# EAGLE design led kocka shematic (EAGLE 8.4.3)
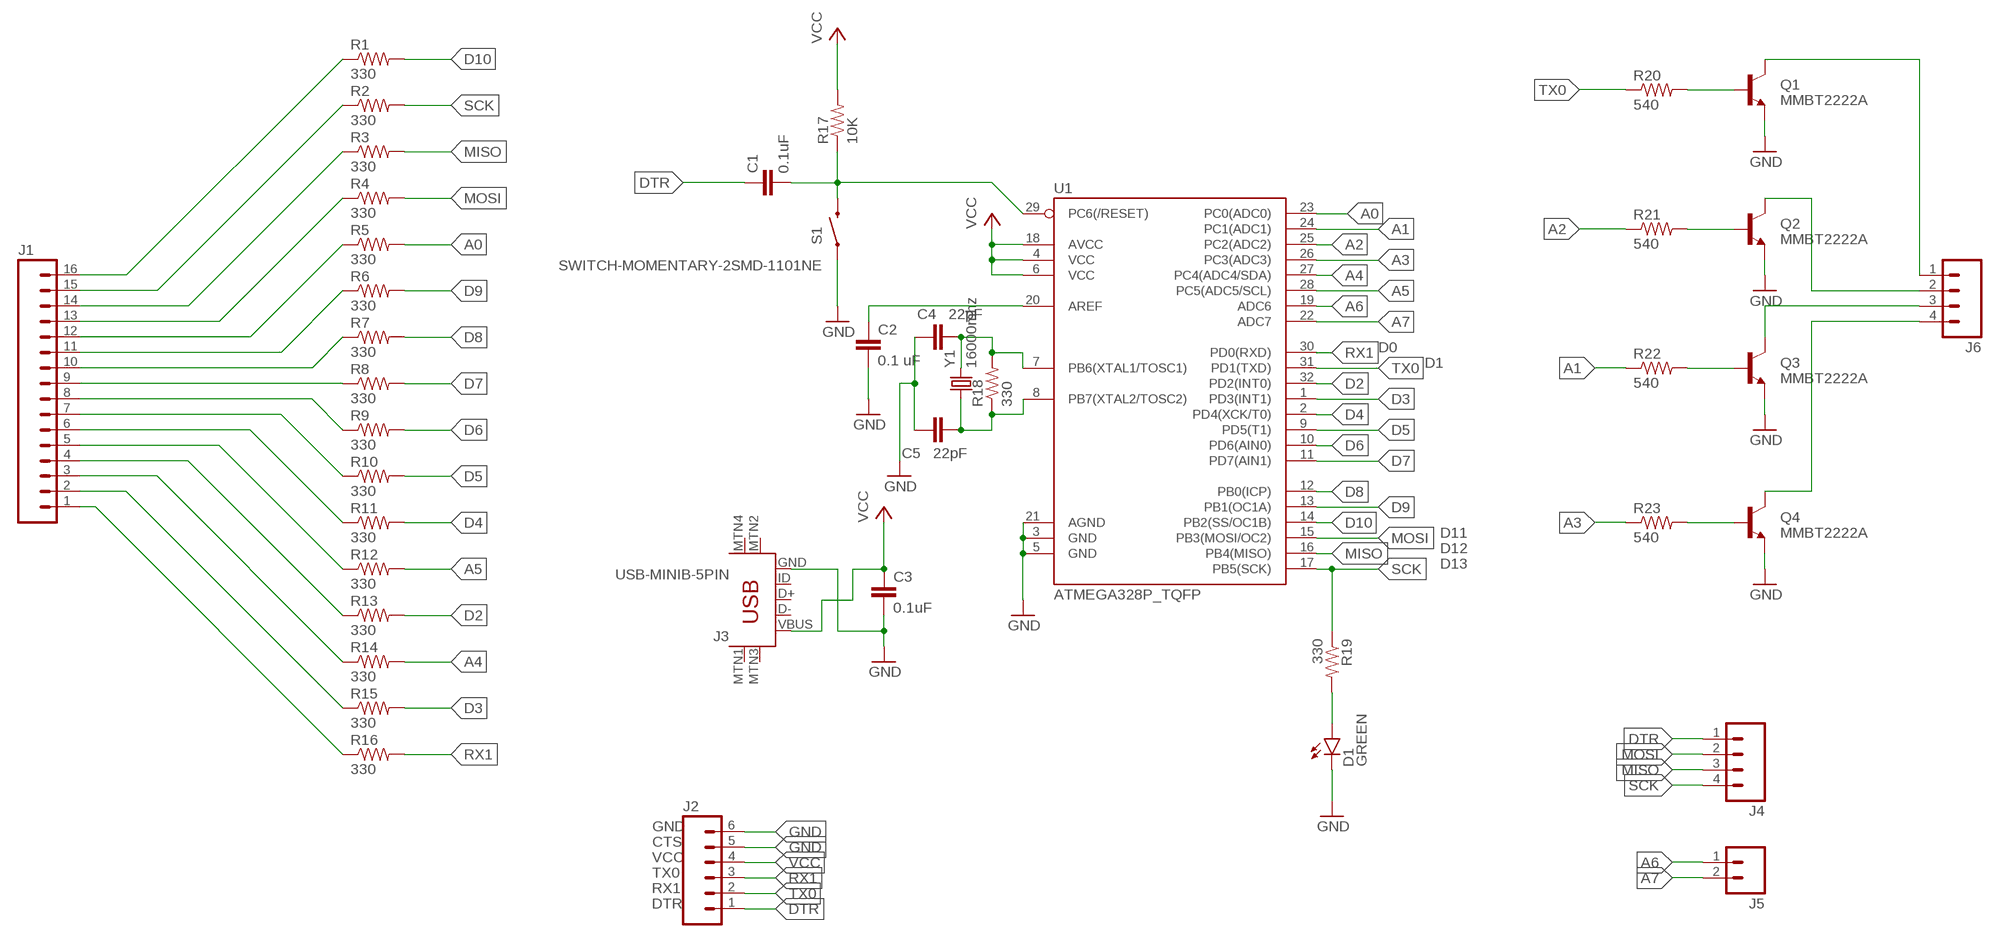
[diagram p0: schematic, sheet 1]

## Parts
C1  0.1uF  1UF-25V-10%(0805)"  [0805-CAP]
C2  0.1 uF  1UF-25V-10%(0805)"  [0805-CAP]
C3  0.1uF  1UF-25V-10%(0805)"  [0805-CAP]
C4  22pF  1UF-25V-10%(0805)"  [0805-CAP]
C5  22pF  1UF-25V-10%(0805)"  [0805-CAP]
D1  GREEN  LED-GREEN0603  [LED-0603]
J1  M16LONGPADS  [1X16_LONGPADS]
J2  M06LONGPADS  [1X06_LONGPADS]
J3  USB-MINIB-5PIN  [USB-MINIB]
J4  M04LONGPADS  [1X04_LONGPADS]
J5  M02LOCK_LONGPADS  [1X02_LOCK_LONGPADS]
J6  M04LONGPADS  [1X04_LONGPADS]
Q1  MMBT2222A  TRANSISTOR_NPNMMBT2222A  [SOT23-3]
Q2  MMBT2222A  TRANSISTOR_NPNMMBT2222A  [SOT23-3]
Q3  MMBT2222A  TRANSISTOR_NPNMMBT2222A  [SOT23-3]
Q4  MMBT2222A  TRANSISTOR_NPNMMBT2222A  [SOT23-3]
R1  330  R-US_R0805  [R0805]
R2  330  R-US_R0805  [R0805]
R3  330  R-US_R0805  [R0805]
R4  330  R-US_R0805  [R0805]
R5  330  R-US_R0805  [R0805]
R6  330  R-US_R0805  [R0805]
R7  330  R-US_R0805  [R0805]
R8  330  R-US_R0805  [R0805]
R9  330  R-US_R0805  [R0805]
R10  330  R-US_R0805  [R0805]
R11  330  R-US_R0805  [R0805]
R12  330  R-US_R0805  [R0805]
R13  330  R-US_R0805  [R0805]
R14  330  R-US_R0805  [R0805]
R15  330  R-US_R0805  [R0805]
R16  330  R-US_R0805  [R0805]
R17  10K  R-US_R0805  [R0805]
R18  330  R-US_R0805  [R0805]
R19  330  R-US_R0805  [R0805]
R20  540  R-US_R0805  [R0805]
R21  540  R-US_R0805  [R0805]
R22  540  R-US_R0805  [R0805]
R23  540  R-US_R0805  [R0805]
S1  SWITCH-MOMENTARY-2SMD-1101NE  [TACTILE-SWITCH-1101NE]
U1  ATMEGA328P_TQFP  [TQFP32-08]
Y1  16000mhz  CRYSTALSMD  [HC49UP]

## Nets
A0: R5.2 U1.23(PC0(ADC0))
A1: R22.1 U1.24(PC1(ADC1))
A2: R21.1 U1.25(PC2(ADC2))
A3: R23.1 U1.26(PC3(ADC3))
A4: R14.2 U1.27(PC4(ADC4/SDA))
A5: R12.2 U1.28(PC5(ADC5/SCL))
A6: J5.1 U1.19(ADC6)
A7: J5.2 U1.22(ADC7)
D2: R13.2 U1.32(PD2(INT0))
D3: R15.2 U1.1(PD3(INT1))
D4: R11.2 U1.2(PD4(XCK/T0))
D5: R10.2 U1.9(PD5(T1))
D6: R9.2 U1.10(PD6(AIN0))
D7: R8.2 U1.11(PD7(AIN1))
D8: R7.2 U1.12(PB0(ICP))
D9: R6.2 U1.13(PB1(OC1A))
D10: R1.2 U1.14(PB2(SS/OC1B))
DTR: C1.1 J2.1 J4.1
GND: C2.2 C3.2 C4.1 C5.1 D1.C J2.5 J2.6 J3.GND Q1.2(E) Q2.2(E) Q3.2(E) Q4.2(E) S1.1 U1.3(GND) U1.5(GND) U1.21(AGND)
MISO: J4.3 R3.2 U1.16(PB4(MISO))
MOSI: J4.2 R4.2 U1.15(PB3(MOSI/OC2))
N$1: C4.2 R18.2 U1.7(PB6(XTAL1/TOSC1)) Y1.2
N$2: J1.16 R1.1
N$3: C1.2 R17.1 S1.2 U1.29(PC6(/RESET))
N$4: C5.2 R18.1 U1.8(PB7(XTAL2/TOSC2)) Y1.1
N$5: C2.1 U1.20(AREF)
N$6: J1.15 R2.1
N$7: J1.14 R3.1
N$8: J1.13 R4.1
N$9: J1.12 R5.1
N$10: J1.11 R6.1
N$11: D1.A R19.2
N$12: J1.1 R16.1
N$13: J1.2 R15.1
N$14: J1.3 R14.1
N$15: J1.4 R13.1
N$16: J1.5 R12.1
N$17: J1.6 R11.1
N$18: J1.7 R10.1
N$19: J1.8 R9.1
N$20: J1.9 R8.1
N$21: J1.10 R7.1
N$38: Q1.1(B) R20.2
N$39: Q2.1(B) R21.2
N$40: Q3.1(B) R22.2
N$41: Q4.1(B) R23.2
N$42: J6.1 Q1.3(C)
N$43: J6.2 Q2.3(C)
N$44: J6.3 Q3.3(C)
N$45: J6.4 Q4.3(C)
RX1: J2.3 R16.2 U1.30(PD0(RXD))
SCK: J4.4 R2.2 R19.1 U1.17(PB5(SCK))
TX0: J2.2 R20.1 U1.31(PD1(TXD))
VCC: C3.1 J2.4 J3.VBUS R17.2 U1.4(VCC) U1.6(VCC) U1.18(AVCC)
Unconnected: J3.D+ J3.D- J3.ID J3.MTN1(MTN2) J3.MTN2(MTN3) J3.MTN3(MTN1) J3.MTN4

## Notes on the sheet
- D0
- D1
- D11
- D12
- D13
- GND
- CTS
- VCC
- TX0
- RX1
- DTR

## Library data of the parts
C1-C5 = SparkFun-Capacitors:1UF-25V-10%(0805): CAP-08064
D1 = SparkFun-LED:LED-GREEN: Various green LEDs Green LEDs used in SFE Production 0603- DIO-00821 LARGE- DIO-00862 LILYPAD- DIO-09910; PROD_ID: DIO-00821
J1 = SparkFun-Connectors:M16: 1x16 .1" header
J2 = SparkFun-Connectors:M06: Header 6 Standard 6-pin 0.1" header. Use with straight break away headers (SKU : PRT-00116), right angle break away headers (PRT-00553), swiss pins (PRT-00743), machine pins (PRT-00117), and female headers (PRT-00115). Molex polarized connector foot print use with SKU : PRT-08094 with associated crimp pins and housings. NOTES ON THE VARIANTS LOCK and LOCK_LONGPADS... This footprint was designed to help hold the alignment of a through-hole component (i.e. 6-pin header) while soldering it into place. You may notice that each hole has been shifted either up or down by 0.005 of an inch from it's more standard position (which is a perfectly straight line). This slight alteration caused the pins (the squares in the middle) to touch the edges of the holes. Because they are alternating, it causes a "brace" to hold the component in place. 0.005 has proven to be the perfect amount of "off-center" position when using our standard breakaway headers. Although looks a little odd when you look at the bare footprint, once you have a header in there, the alteration is very hard to notice. Also,if you push a header all the way into place, it is covered up entirely on the bottom side. This idea of altering the position of holes to aid alignment will be further integrated into the Sparkfun Library for other footprints. It can help hold any component with 3 or more connection pins.
J3 = SparkFun-Connectors:USB-MINIB: Mini-USB "B" connector with 5th pin broken out. Created new symbol breaking out 5th "ID" pin in mini/micro USB connector spec. See: http://en.wikipedia.org/wiki/Mini_usb#Cables. Uses same footprint as 4-pin symbol. Also added pins to connect to mounting / shield pads if required (probably not generally needed as signals aren't shielded once they leave the connector).; PROD_ID: CONN-08193
J4 J6 = SparkFun-Connectors:M04: Header 4 Standard 4-pin 0.1" header. Use with straight break away headers (SKU : PRT-00116), right angle break away headers (PRT-00553), swiss pins (PRT-00743), machine pins (PRT-00117), and female headers (PRT-00115). Molex polarized connector foot print use with SKU : PRT-08231 with associated crimp pins and housings. 1MM SMD Version SKU: PRT-10208; PROD_ID: CONN-09696
J5 = SparkFun-Connectors:M02: Standard 2-pin 0.1" header. Use with - straight break away headers ( PRT-00116) - right angle break away headers (PRT-00553) - swiss pins (PRT-00743) - machine pins (PRT-00117) - female headers (PRT-00115) Molex polarized connector foot print use with: PRT-08233 with associated crimp pins and housings. 2.54_SCREWTERM for use with PRT-10571. 3.5mm Screw Terminal footprints for PRT-08084 5mm Screw Terminal footprints for use with PRT-08432
Q1-Q4 = SparkFun-DiscreteSemi:TRANSISTOR_NPN: Generic NPN BJT MMBT2222A - TRANS-08049 (SOT-23, 1A 40V) MPSA42 - TRANS-09116 (SOT-23, 500mA 300V) MMBT5088LT1G - TRANS-11160 (SOT-23, 50 mA 30V) BC547 - COM-08928 <http://www.sparkfun.com/products/8928> (TO-92 45V 100mA) (1.Collector 2.Base 3.Emitter) 2N3904 - COM-00521 <http://www.sparkfun.com/products/521> (TO-92 40V 200mA) (1.Emitter 2.Base 3.Collector) P2N2222A - COM-12852 <http://www.sparkfun.com/products/12852> (TO-92 40V 600mA) (1.Collector 2.Base 3.Emitter); PROD_ID: TRANS-08049
R1-R23 = rcl:R-US_: RESISTOR, American symbol
S1 = SparkFun-Electromechanical:SWITCH-MOMENTARY-2: Various NO switches- pushbuttons, reed, etc; PROD_ID: SWCH-00815
U1 = SparkFun-IC-Microcontroller:ATMEGA328P_TQFP: Popular 328P in QFP Storefront component: ATmega328 - TQFP <https://www.sparkfun.com/products/13448> (COM-13448) Datasheet <http://www.sparkfun.com/datasheets/Components/SMD/ATMega328.pdf> SparkFun Products SparkFun RedBoard - Programmed with Arduino <https://www.sparkfun.com/products/12757> (DEV-12757) Arduino Pro Mini 328 - 5V/16MHz <https://www.sparkfun.com/products/11113> (DEV-11113) Arduino Pro Mini 328 - 3.3V/8MHz <https://www.sparkfun.com/products/11114> (DEV-11114) SparkFun OpenLog <https://www.sparkfun.com/products/13712> (DEV-13712) SparkFun MicroView - OLED Arduino Module <https://www.sparkfun.com/products/12923> (DEV-12923) SparkFun Digital Sandbox <https://www.sparkfun.com/products/12651> (DEV-12651) SparkFun PicoBoard <https://www.sparkfun.com/products/11888> (WIG-11888) Arduino Fio <https://www.sparkfun.com/products/10116> (DEV-10116) LilyPad Arduino 328 Main Board <https://www.sparkfun.com/products/13342> (DEV-13342) SparkFun RedStick <https://www.sparkfun.com/products/13741> (DEV-13741) LilyPad MP3 <https://www.sparkfun.com/products/11013> (DEV-11013) LilyPad Arduino SimpleSnap <https://www.sparkfun.com/products/10941> (DEV-10941) SparkFun Stepoko <https://www.sparkfun.com/products/13899> (ROB-13899) SparkFun Geiger Counter <https://www.sparkfun.com/products/11345> (SEN-11345) SparkFun EL Sequencer <https://www.sparkfun.com/products/12781> (COM-12781) Arduino Pro 328 - 5V/16MHz <https://www.sparkfun.com/products/10915> (DEV-10915) CryptoCape <https://www.sparkfun.com/products/12773> (DEV-12773) SparkFun IR Thermometer Evaluation Board - MLX90614 <https://www.sparkfun.com/products/10740> (SEN-10740) SparkFun RedBot Mainboard <https://www.sparkfun.com/products/12097> (ROB-12097) Arduino Pro 328 - 3.3V/8MHz <https://www.sparkfun.com/products/10914> (DEV-10914) SparkFun Block for Intel® Edison - Arduino <https://www.sparkfun.com/products/13036> (DEV-13036) SparkFun Simon Says - Surface Mount Soldering Kit <https://www.sparkfun.com/products/10935> (KIT-10935) SparkFun 7-Segment Serial Display - Red <https://www.sparkfun.com/products/11441> (COM-11441) SparkFun 7-Segment Serial Display - White <https://www.sparkfun.com/products/11629> (COM-11629) SparkFun 7-Segment Serial Display - Yellow <https://www.sparkfun.com/products/11443> (COM-11443) SparkFun 7-Segment Serial Display - Kelly Green <https://www.sparkfun.com/products/11440> (COM-11440) SparkFun 7-Segment Serial Display - Blue <https://www.sparkfun.com/products/11442> (COM-11442) SparkFun OpenSegment Serial Display - 20mm (Blue) <https://www.sparkfun.com/products/11647> (COM-11647) SparkFun OpenSegment Serial Display - 20mm (Green) <https://www.sparkfun.com/products/11646> (COM-11646) SparkFun OpenSegment Serial Display - 20mm (White) <https://www.sparkfun.com/products/11648> (COM-11648) SparkFun OpenSegment Serial Display - 20mm (Red) <https://www.sparkfun.com/products/11644> (COM-11644) SparkFun OpenSegment Serial Display - 20mm (Yellow) <https://www.sparkfun.com/products/11645> (COM-11645) SparkFun OpenSegment Shield <https://www.sparkfun.com/products/13190> (DEV-13190); PROD_ID: IC-09069
Y1 = SparkFun-FreqCtrl:CRYSTAL: Various standard crystals. Proven footprints.

## Board
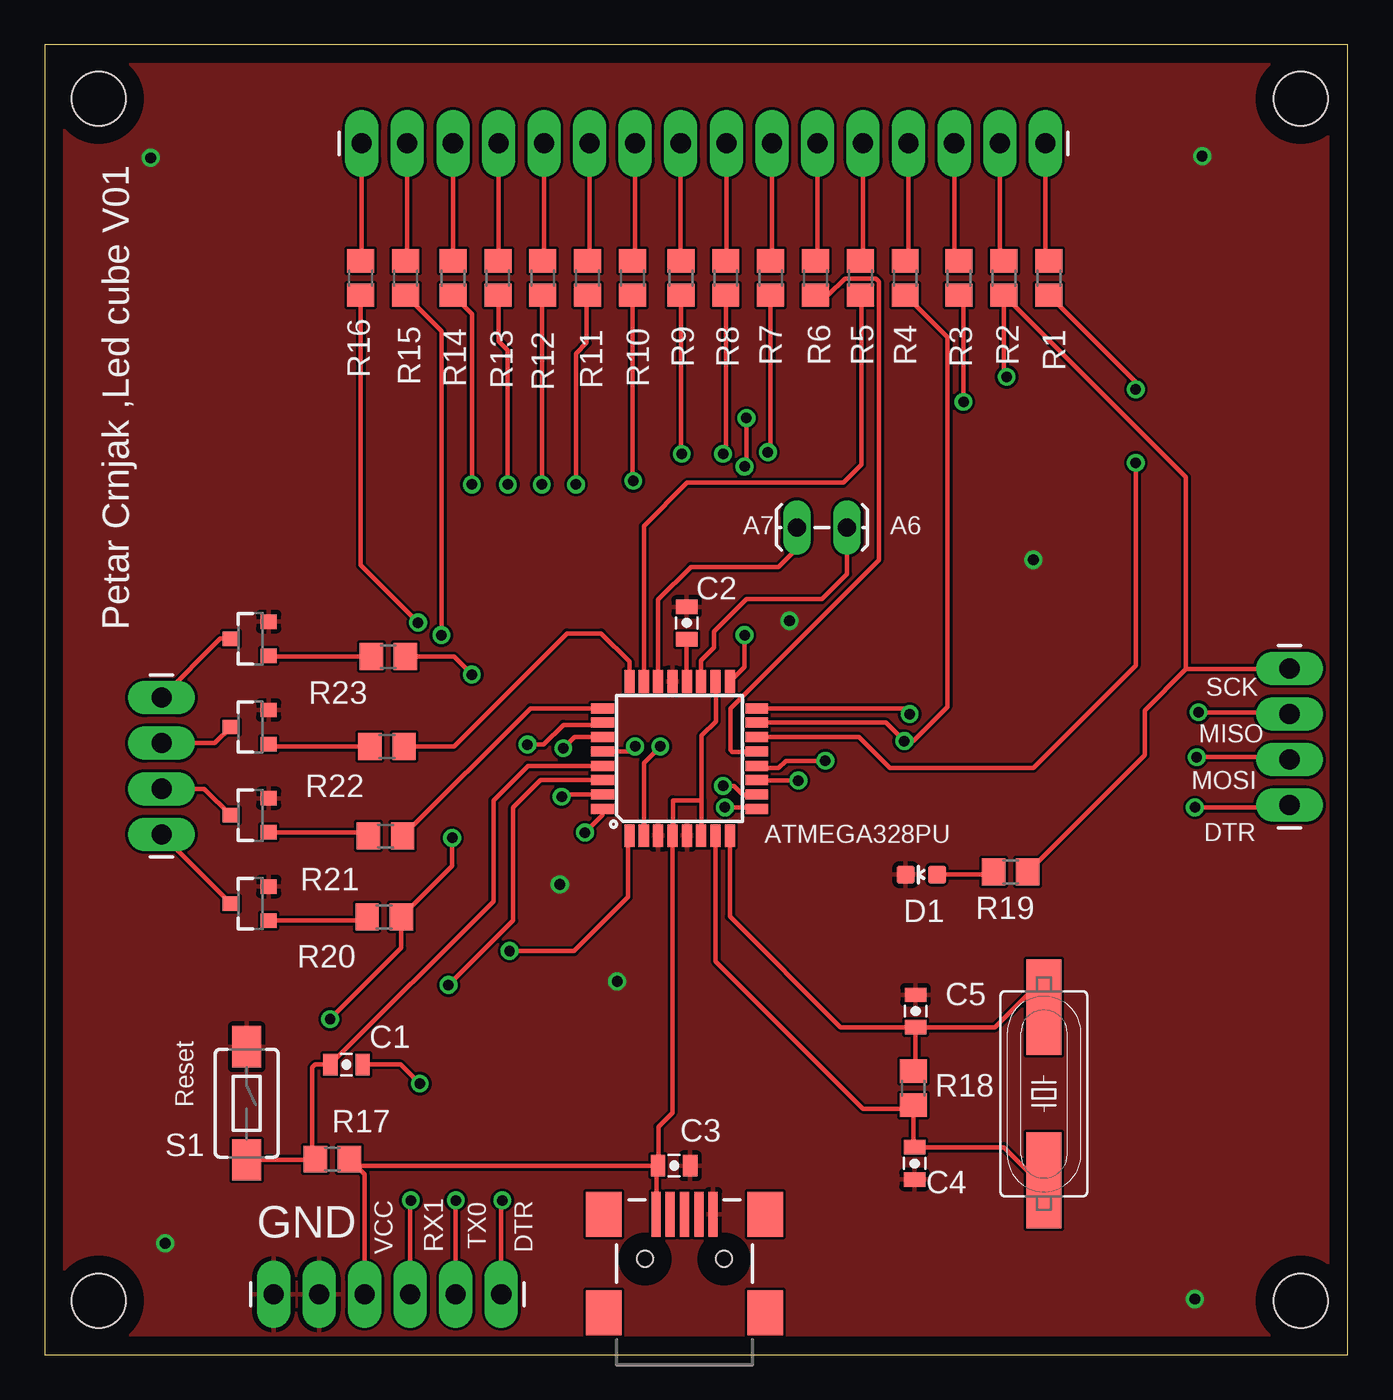
[diagram p1: board, top side]
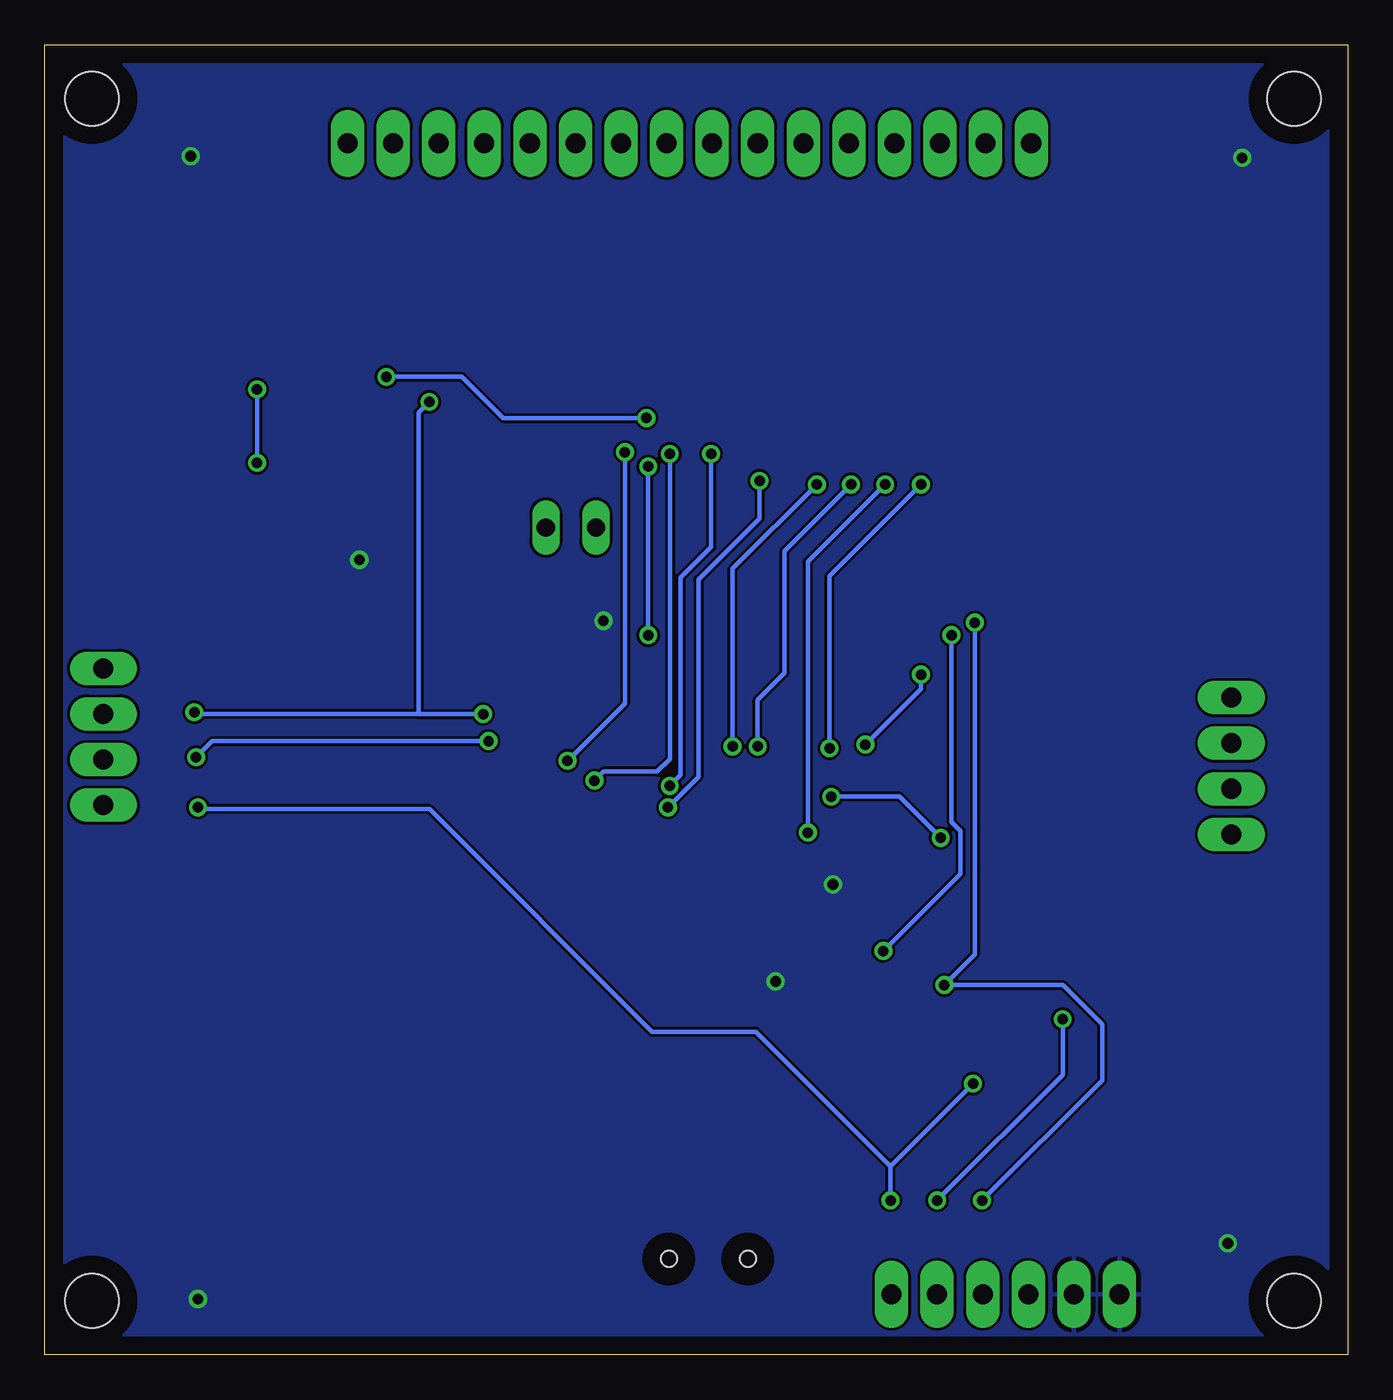
[diagram p2: board, bottom side, seen from below]

Size 72.63 x 73 mm. Coordinates in mm from the lower left corner, seen from the top.
Outline: 0,0 72.63,0 72.63,73 0,73 0,0
Copper layers (1*16): Top 0.035mm / dielectric 1.5mm / Bottom 0.035mm
Design rules "default": minimum track width 6mil, minimum drill 0.35mm, track to track 6mil, track to pad 6mil, pad to pad 6mil, via to via 6mil, smd to smd 6mil, copper to edge 40mil, drill to drill 6mil, minimum pad ring 10mil, minimum via ring 8mil, stop-mask expansion 4mil, vias tented up to drill 0mil, thermal gap 10mil
Holes 3 mm at 3,70 70,70 3,3 70,3

### Footprints (pad centres in the part's own frame; a part is rotated, then mirrored left to right if it is on the bottom)
0805-CAP = smd 0.8 x 1.2: 1 -0.9,0; 2 0.9,0
LED-0603 = smd 1 x 1: A 0,-0.877; C 0,0.877
1X16_LONGPADS = drill 1.118 pad 1.88 long: 1 0,0; 2 2.54,0; 3 5.08,0; 4 7.62,0; 5 10.16,0; 6 12.7,0; 7 15.24,0; 8 17.78,0; 9 20.32,0; 10 22.86,0; 11 25.4,0; 12 27.94,0; 13 30.48,0; 14 33.02,0; 15 35.56,0; 16 38.1,0
1X06_LONGPADS = drill 1.118 pad 1.88 long: 1 0,0; 2 2.54,0; 3 5.08,0; 4 7.62,0; 5 10.16,0; 6 12.7,0
USB-MINIB = smd 2.5 x 0.5: D+ 2.5,0; D- 2.5,0.8; GND 2.5,-1.6; ID 2.5,-0.8; VBUS 2.5,1.6 | smd 2.5 x 2: MTN1 -3,4.5; MTN2 2.5,4.5; MTN3 -3,-4.5; MTN4 2.5,-4.5 | hole 0.9: 0,2.2; 0,-2.2
1X04_LONGPADS = drill 1.118 pad 1.88 long: 1 0,0; 2 2.54,0; 3 5.08,0; 4 7.62,0
1X02_LOCK_LONGPADS = drill 1.016 long: 1 -0.127,0; 2 2.667,0
SOT23-3 = smd 0.8 x 0.9: 1 -0.95,-1; 2 0.95,-1; 3 0,1.1
R0805 = smd 1.3 x 1.5: 1 -0.95,0; 2 0.95,0
TACTILE-SWITCH-1101NE = smd 2.3 x 1.6: 1 -3.15,0; 2 3.15,0
TQFP32-08 = smd 1.27 x 0.559: 1 -4.293,2.8; 2 -4.293,2; 3 -4.293,1.2; 4 -4.293,0.4; 5 -4.293,-0.4; 6 -4.293,-1.2; 7 -4.293,-2; 8 -4.293,-2.8; 17 4.293,-2.8; 18 4.293,-2; 19 4.293,-1.2; 20 4.293,-0.4; 21 4.293,0.4; 22 4.293,1.2; 23 4.293,2; 24 4.293,2.8 | smd 0.559 x 1.27: 9 -2.8,-4.293; 10 -2,-4.293; 11 -1.2,-4.293; 12 -0.4,-4.293; 13 0.4,-4.293; 14 1.2,-4.293; 15 2,-4.293; 16 2.8,-4.293; 25 2.8,4.293; 26 2,4.293; 27 1.2,4.293; 28 0.4,4.293; 29 -0.4,4.293; 30 -1.2,4.293; 31 -2,4.293; 32 -2.8,4.293
HC49UP = smd 5.334 x 1.93: 1 -4.826,0; 2 4.826,0

### Placement (x,y rotation side)
C1  16.81,16.17 180 top
C2  35.77,40.78 90 top
C3  35.07,10.53 0 top
C4  48.47,10.66 90 top
C5  48.53,19.15 270 top
D1  48.85,26.76 90 top
J1  17.66,67.51 0 top
J2  25.44,3.37 180 top
J3  35.65,5.33 90 top
J4  69.37,30.63 90 top
J5  44.58,46.1 180 top
J6  6.5,29 90 top
Q1  11.47,25.14 90 top
Q2  11.47,30.06 90 top
Q3  11.47,34.98 90 top
Q4  11.47,39.9 90 top
R1  55.95,60 270 top
R2  53.45,60 270 top
R3  50.95,60 270 top
R4  47.95,60 270 top
R5  45.45,60 270 top
R6  42.95,60 270 top
R7  40.45,60 270 top
R8  37.95,60 270 top
R9  35.45,60 270 top
R10  32.75,60 270 top
R11  30.25,60 270 top
R12  27.75,60 270 top
R13  25.25,60 270 top
R14  22.75,60 270 top
R15  20.1,60 270 top
R16  17.6,60 270 top
R17  16.03,10.9 0 top
R18  48.4,14.85 270 top
R19  53.83,26.9 180 top
R20  18.91,24.4 180 top
R21  18.99,28.9 180 top
R22  19.07,33.9 180 top
R23  19.15,38.9 180 top
S1  11.25,14.01 270 top
U1  35.38,33.22 90 top
Y1  55.68,14.54 270 top

### Tracks (layer width: path | path; a pad name or v marks a point on that pad's centre or on a via)
A0
  Top 0.254: U1.23 33.38,46.18 35.8,48.6 44.5,48.6 45.5,49.6 45.5,59 R5.2
A1
  Top 0.254: R22.1 22.8,33.9 29.1,40.2 31,40.2 32.58,38.62 U1.24
A2
  Top 0.254: R21.1 27.06,36.02 U1.25
A3  (via drill 0.58)
  Top 0.254: R23.1 22.8,38.9 v23.8,37.9 | v26.9,34 27.8,34 28.9,35.1 30.97,35.1 U1.26
  Bottom 0.254: v23.8,37.9 23.8,37.1 v26.9,34
A4  (via drill 0.58)
  Top 0.254: U1.27 29.52,34.42 v28.9,33.8 | v23.8,48.5 23.8,58 R14.2
  Bottom 0.254: v28.9,33.8 28.9,43.4 v23.8,48.5
A5  (via drill 0.58)
  Top 0.254: U1.28 32.62,33.62 v32.9,33.9 | v27.7,48.5 27.7,59 R12.2
  Bottom 0.254: v32.9,33.9 32.9,36.5 31.4,38 31.4,44.8 v27.7,48.5
A6
  Top 0.254: U1.19 36.58,38.68 37.3,39.4 37.3,40.3 39.1,42.1 43.3,42.1 44.71,43.51 J5.1
A7
  Top 0.254: U1.22 34.18,42.08 36,43.9 40.9,43.9 41.91,44.91 J5.2
D2  (via drill 0.58)
  Top 0.254: U1.32 31.09,30.09 v30.1,29.1 | v25.8,48.5 25.8,56 25.3,56.5 25.3,59 R13.2
  Bottom 0.254: v30.1,29.1 30.1,44.2 v25.8,48.5
D3  (via drill 0.58)
  Top 0.254: R15.2 22.1,57.05 v22.1,40.1 | v25.9,22.5 29.5,22.5 32.5,25.5 32.5,28.85 U1.1
  Bottom 0.254: v22.1,40.1 22.1,29.7 21.6,29.2 21.6,26.8 v25.9,22.5
D4  (via drill 0.58)
  Top 0.254: U1.2 33.38,32.98 v34.3,33.9 | v29.6,48.5 29.6,55.8 30.2,56.4 30.2,59 R11.2
  Bottom 0.254: v34.3,33.9 34.3,43.8 v29.6,48.5
D5  (via drill 0.58)
  Top 0.254: R10.2 32.75,48.75 v32.8,48.7 | v37.9,30.5 39.59,30.5 U1.9
  Bottom 0.254: v32.8,48.7 32.8,46.6 36.2,43.2 36.2,32.2 v37.9,30.5
D6  (via drill 0.58)
  Top 0.254: R9.2 35.45,50.25 v35.5,50.2 | v37.8,31.7 38.4,31.7 38.9,31.2 39.65,31.2 U1.10
  Bottom 0.254: v35.5,50.2 35.5,45 37.2,43.3 37.2,32.3 v37.8,31.7
D7  (via drill 0.58)
  Top 0.254: R8.2 37.95,50.35 v37.8,50.2 | v42,32 39.69,32 U1.11
  Bottom 0.254: v37.8,50.2 37.8,33.2 38.5,32.5 41.5,32.5 v42,32
D8  (via drill 0.58)
  Top 0.254: R7.2 40.45,50.45 v40.3,50.3 | v43.5,33.1 41.3,33.1 40.9,32.7 39.79,32.7 U1.12
  Bottom 0.254: v40.3,50.3 40.3,36.3 v43.5,33.1
D9
  Top 0.254: R6.2 43.66,59.05 44.58,59.98 46.32,59.98 46.48,59.82 46.48,44.28 38.2,36 38.2,33.7 38.3,33.6 39.65,33.6 U1.13
D10  (via drill 0.58)
  Top 0.254: R1.2 60.8,54.2 v60.8,53.8 | v60.8,49.7 60.8,38.4 55.1,32.7 47.1,32.7 45.38,34.42 U1.14
  Bottom 0.254: v60.8,53.8 v60.8,49.7
DTR  (via drill 0.58)
  Top 0.254: J2.1 25.44,8.54 v25.5,8.6 | v20.9,15.1 19.83,16.17 C1.1 | v64.1,30.5 69.24,30.5 J4.1
  Bottom 0.254: v25.5,8.6 25.5,10.5 | 25.5,10.5 v20.9,15.1 | 25.5,10.5 33,18 38.8,18 51.2,30.4 64,30.4 v64.1,30.5
GND  (via drill 0.6)
  other vias: 5.9,66.7 64.5,66.8 64.1,3.1 6.7,6.2 31.9,20.8 55.1,44.3 28.7,26.2 41.5,40.9
  pour Top: -2,75 -2,-1 6,-2 74,-2 74,75
  pour Bottom: -2.9,73.9 -2.9,-1.7 77.4,-1.7 77.4,73.9
MISO  (via drill 0.58)
  Top 0.254: J4.3 69.28,35.8 v64.3,35.8 | v48.2,35.7 47.88,36.02 U1.16 | R3.2 51.2,58.8 v51.2,53.1
  Bottom 0.254: v64.3,35.8 64.2,35.7 51.8,35.7 | 51.8,35.7 v48.2,35.7 | v51.2,53.1 51.8,52.5 51.8,35.7
MOSI  (via drill 0.58)
  Top 0.254: J4.2 69.24,33.3 v64.2,33.3 | U1.15 46.88,35.22 v47.9,34.2 48.4,34.2 50.3,36.1 50.3,56.7 R4.2
  Bottom 0.254: v64.2,33.3 63.3,34.2 v47.9,34.2
N$1
  Top 0.254: 48.6,11.56 C4.2 | 48.6,11.56 53.44,11.56 55.9,9.1 55.9,9.49 Y1.2 | 48.4,13.7 R18.2 | 48.4,13.7 48.4,11.76 48.6,11.56 | U1.7 37.38,21.92 45.6,13.7 48.4,13.7
N$2
  Top 0.254: J1.16 55.76,61.14 R1.1
N$3
  Top 0.254: 14.9,10.86 S1.2 | 14.9,10.86 15.04,10.86 R17.1 | 14.9,10.86 14.9,16 15.07,16.17 C1.2 25,25.26 25,30.9 26.92,32.82 U1.29
N$4
  Top 0.254: 48.6,18.25 52.95,18.25 55.5,20.8 | 48.6,18.25 C5.2 48.53,15.93 R18.1 | 55.5,20.8 55.7,21 | U1.8 38.18,24.42 44.35,18.25 48.6,18.25 | Y1.1 55.9,19.59 55.9,20.1 55.5,20.5 55.5,20.8
N$5
  Top 0.254: 35.88,37.62 35.97,37.7 | 35.88,37.62 U1.20 | C2.1 35.77,37.73 35.88,37.62
N$6
  Top 0.254: J1.15 53.22,61.18 R2.1
N$7
  Top 0.254: J1.14 50.68,61.22 R3.1
N$8
  Top 0.254: J1.13 48.14,61.14 R4.1
N$9
  Top 0.254: J1.12 45.6,61.1 R5.1
N$10
  Top 0.254: J1.11 43.06,61.06 R6.1
N$11
  Top 0.254: D1.A 52.74,26.76 R19.2
N$12
  Top 0.254: J1.1 17.66,61.01 R16.1
N$13
  Top 0.254: J1.2 20.2,61.05 R15.1
N$14
  Top 0.254: J1.3 R14.1
N$15
  Top 0.254: J1.4 25.28,60.98 R13.1
N$16
  Top 0.254: J1.5 27.82,61.02 R12.1
N$17
  Top 0.254: J1.6 30.36,61.06 R11.1
N$18
  Top 0.254: J1.7 32.9,61.1 R10.1
N$19
  Top 0.254: J1.8 R9.1
N$20
  Top 0.254: J1.9 37.98,60.98 R8.1
N$21
  Top 0.254: J1.10 40.52,61.02 R7.1
N$38
  Top 0.254: Q1.1 17.75,24.19 R20.2
N$39
  Top 0.254: Q2.1 17.83,29.11 R21.2
N$40
  Top 0.254: Q3.1 12.6,33.9 R22.2
N$41
  Top 0.254: Q4.1 12.52,38.9 R23.2
N$42
  Top 0.254: J6.1 Q1.3
N$43
  Top 0.254: J6.2 8.89,31.54 Q2.3
N$44
  Top 0.254: J6.3 9.47,34.08 Q3.3
N$45
  Top 0.254: J6.4 9.78,39.9 Q4.3
RX1  (via drill 0.58)
  Top 0.254: J2.3 20.36,8.56 v20.4,8.6 | v22.5,20.6 26.1,24.2 26.1,30.5 27.62,32.02 U1.30 | R16.2 17.6,44 v20.8,40.8
  Bottom 0.254: 20.4,9 v20.4,8.6 13.7,15.3 13.7,18.4 15.9,20.6 v22.5,20.6 20.8,22.3 v20.8,40.8
SCK  (via drill 0.58)
  Top 0.254: R19.1 61.3,33.42 61.3,35.9 63.6,38.2 | 63.6,38.2 63.6,48.9 R2.2 53.45,54.65 v53.6,54.5 | v39.1,52.2 39.1,49.6 v39,49.5 | v39,40.1 39,38.33 U1.17 | J4.4 69.32,38.2 63.6,38.2
  Bottom 0.254: v53.6,54.5 49.4,54.5 47.1,52.2 v39.1,52.2 | v39,49.5 v39,40.1
TX0  (via drill 0.58)
  Top 0.254: v15.9,18.7 19.86,22.66 R20.1 22.7,27.24 v22.7,28.8 | 22.9,4.4 v22.9,8.6 | 22.9,4.4 22.8,4.3 | v28.8,31.1 28.92,31.22 U1.31 | J2.2 22.9,4.4
  Bottom 0.254: v15.9,18.7 15.9,15.6 v22.9,8.6 | v22.7,28.8 25,31.1 v28.8,31.1
VCC
  Top 0.254: 36.6,30.9 35,30.9 35,28.95 U1.4 34.98,13.48 34.2,12.7 34.2,10.56 C3.1 | 36.6,30.9 36.6,28.95 U1.6 | C3.1 34.1,10.46 34.1,8.5 34.05,8.45 J3.VBUS | J2.4 17.82,10.06 R17.2 17.35,10.53 C3.1 | 36.6,30.9 36.6,34.5 37.4,35.3 37.4,37.49 U1.18

### Text on the board
tNames: A7 | A6 | Petar Crnjak ,Led cube V01 | SCK | MISO | MOSI | DTR | ATMEGA328PU | Reset | GND | VCC | RX1 | TX0 | DTR